# Altium schematic sheet STM32F103C8T6_Subentry.SchDoc
size 558 x 520 mm
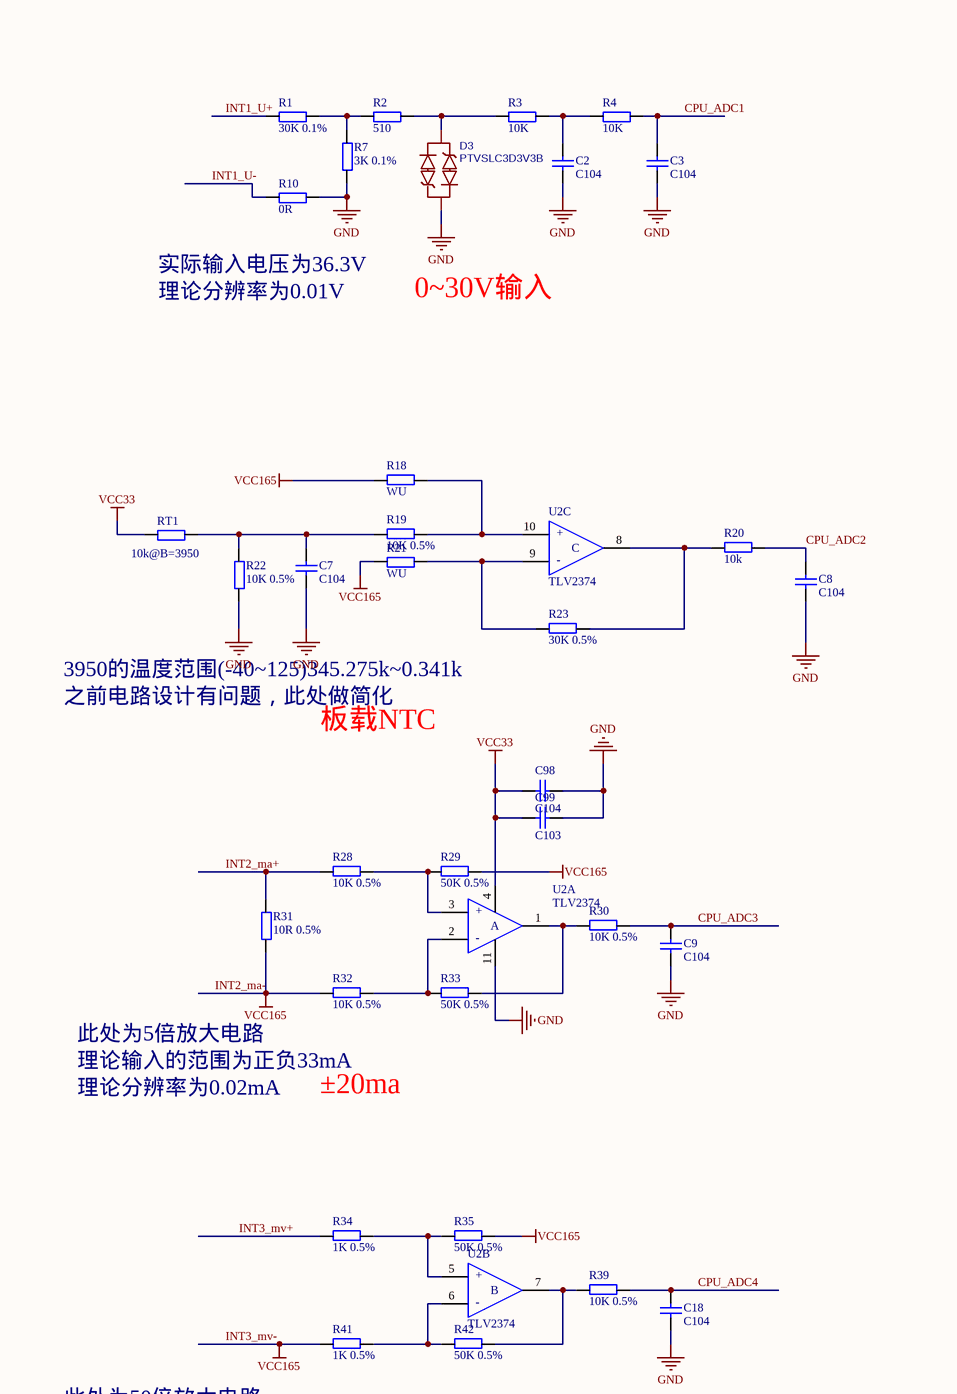
[diagram p0: STM32F103C8T6_Subentry.SchDoc, top left]
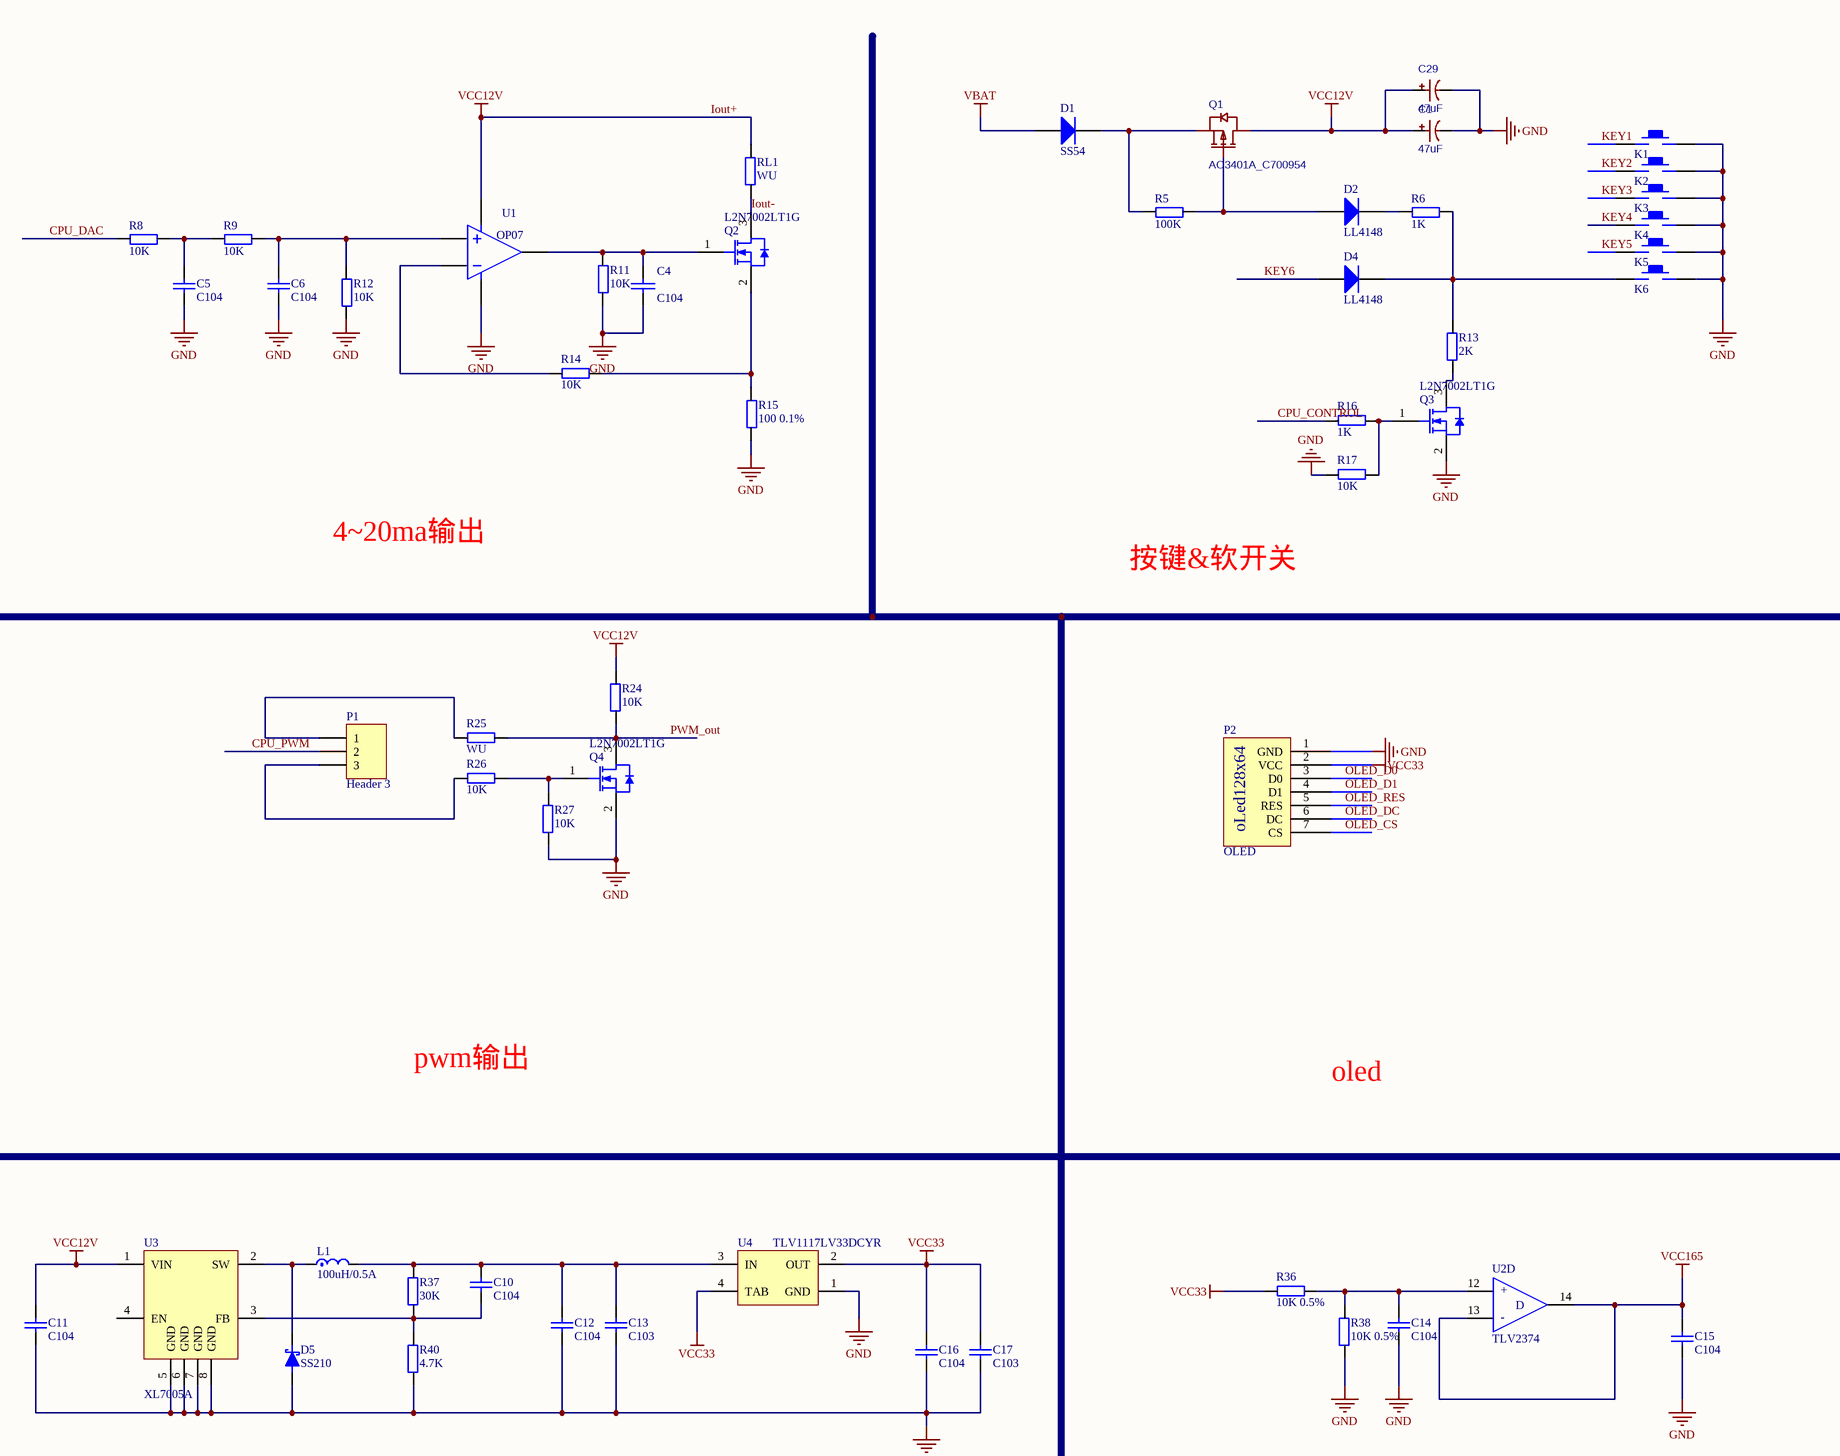
[diagram p1: STM32F103C8T6_Subentry.SchDoc, top right]
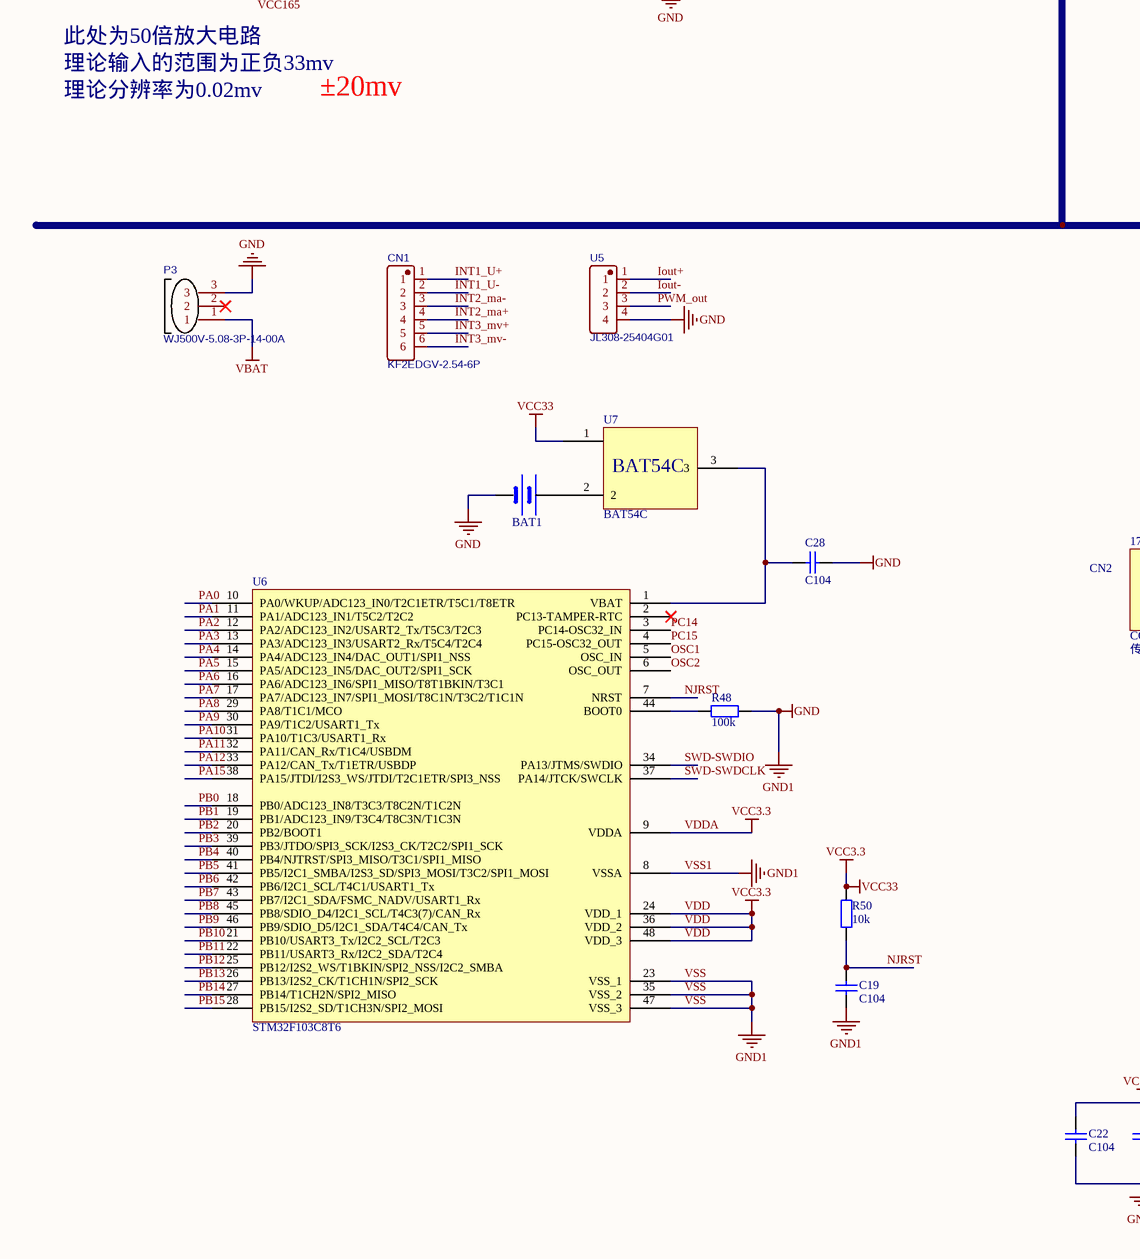
[diagram p2: STM32F103C8T6_Subentry.SchDoc, bottom left]
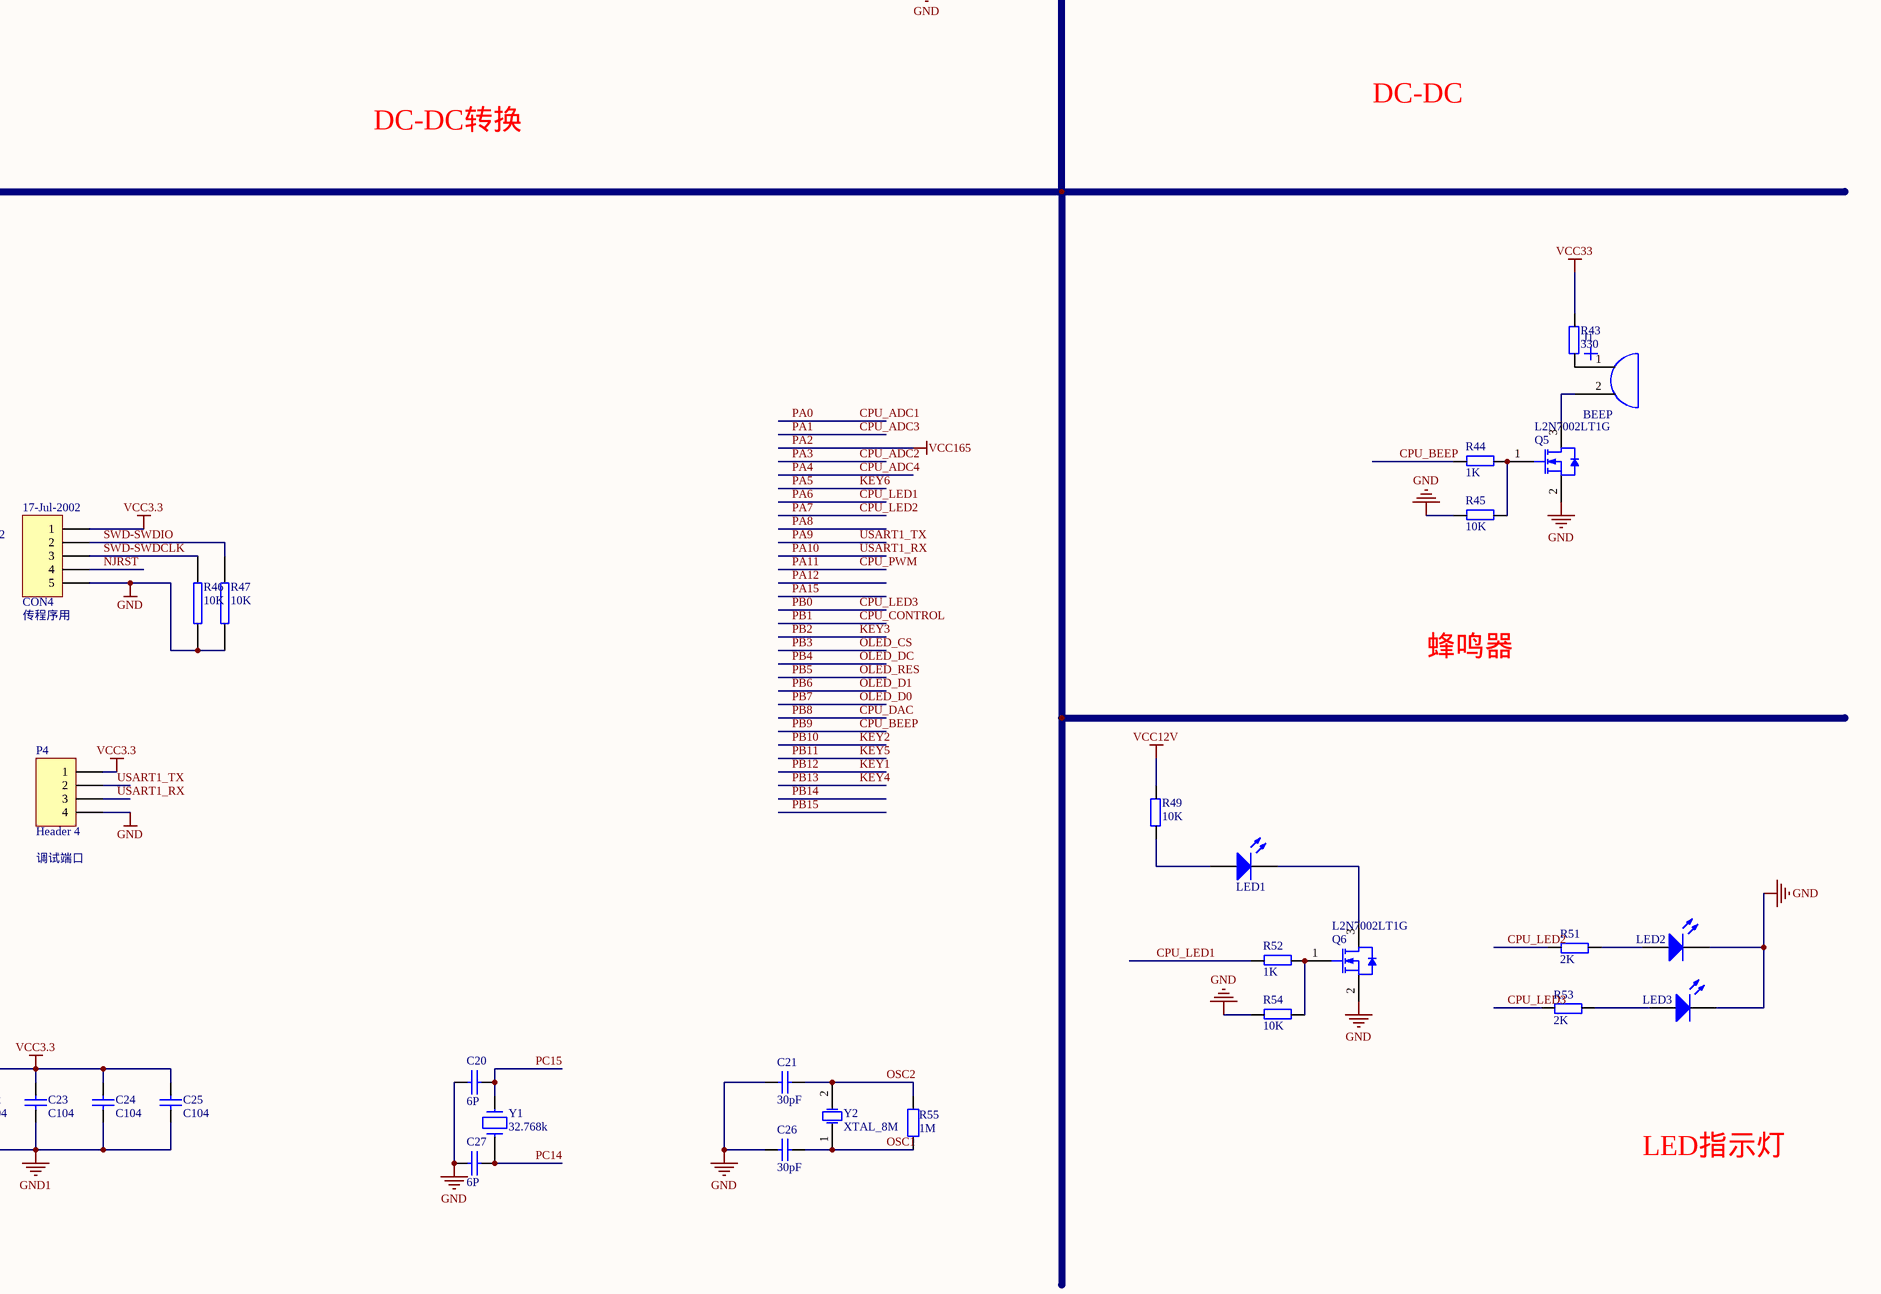
[diagram p3: STM32F103C8T6_Subentry.SchDoc, bottom right]

## Parts
BAT1  BATT  [CR1220]  (value not drawn)
C1  47uF  [CAP-TH_BD5.0-P2.00-D0.8-FD]
C2  C104  [C0805]
C3  C104  [C0805]
C4  C104  [C0805]
C5  C104  [C0805]
C6  C104  [C0805]
C7  C104  [C0805]
C8  C104  [C0805]
C9  C104  [C0805]
C10  C104  [C0805]
C11  C104  [C0805]
C12  C104  [C0805]
C13  C103  [C0805]
C14  C104  [C0805]
C15  C104  [C0805]
C16  C104  [C0805]
C17  C103  [C0805]
C18  C104  [C0805]
C19  C104  [C0805]
C20  6P  [C0805]
C21  30pF  [C0805]
C22  C104  [C0805]
C23  C104  [C0805]
C24  C104  [C0805]
C25  C104  [C0805]
C26  30pF  [C0805]
C27  6P  [C0805]
C28  C104  [C0805]
C29  47uF  [CAP-TH_BD5.0-P2.00-D0.8-FD]
C98  C104  [C0805]
C99  C103  [C0805]
CN1  KF2EDGV-2.54-6P  [CONN-TH_6P-P2.54_KF2EDGV-2.54-6P]
CN2  CON4  LatestRevisionDate: 17-Jul-2002  [HDR1X5]
D1  SS54  [DIODE-SMB]
D2  LL4148  [LL-34_L3.5-W1.5-RD]
D3  PTVSLC3D3V3B  [SOD-323_L1.8-W1.3-LS2.5-BI]
D4  LL4148  [LL-34_L3.5-W1.5-RD]
D5  SS210  [SMA]
J1  BEEP  [Beep]
K1  KEY_M  [K0.25]  (value not drawn)
K2  KEY_M  [K0.25]  (value not drawn)
K3  KEY_M  [K0.25]  (value not drawn)
K4  KEY_M  [K0.25]  (value not drawn)
K5  KEY_M  [K0.25]  (value not drawn)
K6  KEY_M  [K0.25]  (value not drawn)
L1  100uH/0.5A  [L0630]
LED1  LED  [LED-0603 - duplicate]  (value not drawn)
LED2  LED  [LED-0603 - duplicate]  (value not drawn)
LED3  LED  [LED-0603 - duplicate]  (value not drawn)
P1  Header 3  [HDR1X3]
P2  OLED  [OLED]
P3  WJ500V-5.08-3P-14-00A  [CONN-TH_3P-P5.00_WJ500V-5.08-3P]
P4  Header 4  [HDR1X4]
Q1  AO3401A_C700954  [SOT-23]
Q2  L2N7002LT1G  [SOT-23]
Q3  L2N7002LT1G  [SOT-23]
Q4  L2N7002LT1G  [SOT-23]
Q5  L2N7002LT1G  [SOT-23]
Q6  L2N7002LT1G  [SOT-23]
R1  30K 0.1%  [R1206]
R2  510  [R0805]
R3  10K  [R0805]
R4  10K  [R0805]
R5  100K  [R0805]
R6  1K  [R0805]
R7  3K 0.1%  [R1206]
R8  10K  [R0805]
R9  10K  [R0805]
R10  0R  [R1206]
R11  10K  [R0805]
R12  10K  [R0805]
R13  2K  [R0805]
R14  10K  [R0805]
R15  100 0.1%  [R0805]
R16  1K  [R0805]
R17  10K  [R0805]
R18  WU  [R0805]
R19  10K 0.5%  [R0805]
R20  10k  [R0805]
R21  WU  [R0805]
R22  10K 0.5%  [R0805]
R23  30K 0.5%  [R0805]
R24  10K  [R0805]
R25  WU  [R0805]
R26  10K  [R0805]
R27  10K  [R0805]
R28  10K 0.5%  [R0805]
R29  50K 0.5%  [R0805]
R30  10K 0.5%  [R0805]
R31  10R 0.5%  [R0805]
R32  10K 0.5%  [R0805]
R33  50K 0.5%  [R0805]
R34  1K 0.5%  [R0805]
R35  50K 0.5%  [R0805]
R36  10K 0.5%  [R0805]
R37  30K  [R0805]
R38  10K 0.5%  [R0805]
R39  10K 0.5%  [R0805]
R40  4.7K  [R0805]
R41  1K 0.5%  [R0805]
R42  50K 0.5%  [R0805]
R43  330  [R0805]
R44  1K  [R0805]
R45  10K  [R0805]
R46  10K  [R0805]
R47  10K  [R0805]
R48  100k  [R0805]
R49  10K  [R0805]
R50  10k  [R0805]
R51  2K  [R0805]
R52  1K  [R0805]
R53  2K  [R0805]
R54  10K  [R0805]
R55  1M  [R0805]
RL1  WU  [R1206]
RT1  10k@B=3950  [R0603]
U1  OP07  [SOP8]
U2  TLV2374  [SOP14]  (parts A,B,C,D of 4)
U3  XL7005A  [SOP8]
U4  TLV1117LV33DCYR  [SOT-223]
U5  JL308-25404G01  [CONN-TH_4P-P2.54_JILN_JL308-25404G01]
U6  STM32F103C8T6  [LQFP48_L]
U7  BAT54C  [SOT-23]
Y1  32.768k  [XTAL32]
Y2  XTAL_8M  [XTAL_US]

## Nets
INT2_ma-: C15.2 CN1.3 CN1.6 R18.2 R21.1 R29.1 R31.1 R32.2 R35.1 R41.2 U2.13(4IN-) U2.14(4OUT) U6.12(PA2/ADC123_IN2/USART2_Tx/T5C3/T2C3)  [also labelled INT3_mv-, PA2, VCC165]
Iout+: C1.1 C11.2 C29.1 Q1.3(D) R24.1 R49.1 RL1.1 U1.7 U3.1(VIN) U5.1  [also labelled VCC12V]
VBAT: D1.1(A) P3.1
VDD: C16.2 C17.2 C22.2 C23.2 C24.2 C25.2 C98.2 C99.2 CN2.1 P2.2(VCC) P4.1 R36.2 R43.1 R50.2 RT1.1 U2.4(VCC) U4.2(OUT) U4.4(TAB) U6.9(VDDA) U6.24(VDD_1) U6.36(VDD_2) U6.48(VDD_3) U7.1  [also labelled VCC3.3, VCC33, VDDA]
VSS: BAT1.2(GND) C1.2 C2.1 C3.1 C4.2 C5.1 C6.1 C7.1 C8.1 C9.1 C11.1 C12.1 C13.1 C14.1 C15.1 C16.1 C17.1 C18.1 C19.1 C20.2 C21.2 C22.1 C23.1 C24.1 C25.1 C26.2 C27.2 C28.1 C29.2 C98.1 C99.1 CN2.5 D3.1 D5.1(A) K1.1 K2.1 K3.1 K4.1 K5.1 K6.2 LED2.2(K) LED3.2(K) P2.1(GND) P3.3 P4.4 Q3.2(S) Q4.2(S) Q5.2(S) Q6.2(S) R7.1 R10.2 R11.1 R12.1 R15.1 R17.2 R22.1 R27.2 R38.2 R40.2 R45.2 R46.1 R47.1 R48.2 R54.2 U1.4 U2.11(GND) U3.5(GND) U3.6(GND) U3.7(GND) U3.8(GND) U4.1(GND) U5.4 U6.8(VSSA) U6.23(VSS_1) U6.35(VSS_2) U6.47(VSS_3)  [also labelled GND, GND1, VSS1]
CPU_ADC1: C3.2 R4.2 U6.10(PA0/WKUP/ADC123_IN0/T2C1ETR/T5C1/T8ETR)  [also labelled PA0]
CPU_ADC2: C8.2 R20.1 U6.13(PA3/ADC123_IN3/USART2_Rx/T5C4/T2C4)  [also labelled PA3]
CPU_ADC3: C9.2 R30.1 U6.11(PA1/ADC123_IN1/T5C2/T2C2)  [also labelled PA1]
CPU_ADC4: C18.2 R39.1 U6.14(PA4/ADC123_IN4/DAC_OUT1/SPI1_NSS)  [also labelled PA4]
CPU_BEEP: R44.2 U6.46(PB9/SDIO_D5/I2C1_SDA/T4C4/CAN_Tx)  [also labelled PB9]
CPU_CONTROL: R16.2 U6.19(PB1/ADC123_IN9/T3C4/T8C3N/T1C3N)  [also labelled PB1]
CPU_DAC: R8.1 U6.45(PB8/SDIO_D4/I2C1_SCL/T4C3(7)/CAN_Rx)  [also labelled PB8]
CPU_LED1: R52.2 U6.16(PA6/ADC123_IN6/SPI1_MISO/T8T1BKIN/T3C1)  [also labelled PA6]
CPU_LED2: R51.1 U6.17(PA7/ADC123_IN7/SPI1_MOSI/T8C1N/T3C2/T1C1N)  [also labelled PA7]
CPU_LED3: R53.1 U6.18(PB0/ADC123_IN8/T3C3/T8C2N/T1C2N)  [also labelled PB0]
CPU_PWM: P1.2 U6.32(PA11/CAN_Rx/T1C4/USBDM)  [also labelled PA11]
INT1_U+: CN1.1 R1.1
INT1_U-: CN1.2 R10.1
INT2_ma+: CN1.4 R28.2 R31.2
INT3_mv+: CN1.5 R34.2
Iout-: Q2.3(D) RL1.2 U5.2
KEY1: K1.2 U6.25(PB12/I2S2_WS/T1BKIN/SPI2_NSS/I2C2_SMBA)  [also labelled PB12]
KEY2: K2.2 U6.21(PB10/USART3_Tx/I2C2_SCL/T2C3)  [also labelled PB10]
KEY3: K3.2 U6.20(PB2/BOOT1)  [also labelled PB2]
KEY4: K4.2 U6.26(PB13/I2S2_CK/T1CH1N/SPI2_SCK)  [also labelled PB13]
KEY5: K5.2 U6.22(PB11/USART3_Rx/I2C2_SDA/T2C4)  [also labelled PB11]
KEY6: D4.1(A) U6.15(PA5/ADC123_IN5/DAC_OUT2/SPI1_SCK)  [also labelled PA5]
NJRST: C19.2 CN2.4 R50.1 U6.7(NRST)
OLED_CS: P2.7(CS) U6.39(PB3/JTDO/SPI3_SCK/I2S3_CK/T2C2/SPI1_SCK)  [also labelled PB3]
OLED_D0: P2.3(D0) U6.43(PB7/I2C1_SDA/FSMC_NADV/USART1_Rx)  [also labelled PB7]
OLED_D1: P2.4(D1) U6.42(PB6/I2C1_SCL/T4C1/USART1_Tx)  [also labelled PB6]
OLED_DC: P2.6(DC) U6.40(PB4/NJTRST/SPI3_MISO/T3C1/SPI1_MISO)  [also labelled PB4]
OLED_RES: P2.5(RES) U6.41(PB5/I2C1_SMBA/I2S3_SD/SPI3_MOSI/T3C2/SPI1_MOSI)  [also labelled PB5]
OSC1: C26.1 R55.1 U6.5(OSC_IN) Y2.1(OSC1)
OSC2: C21.1 R55.2 U6.6(OSC_OUT) Y2.2(OSC2)
PA8: U6.29(PA8/T1C1/MCO)
PA9: P4.2 U6.30(PA9/T1C2/USART1_Tx)  [also labelled USART1_TX]
PA10: P4.3 U6.31(PA10/T1C3/USART1_Rx)  [also labelled USART1_RX]
PA12: U6.33(PA12/CAN_Tx/T1ETR/USBDP)
PA15: U6.38(PA15/JTDI/I2S3_WS/JTDI/T2C1ETR/SPI3_NSS)
PB14: U6.27(PB14/T1CH2N/SPI2_MISO)
PB15: U6.28(PB15/I2S2_SD/T1CH3N/SPI2_MOSI)
PC14: C27.1 U6.3(PC14-OSC32_IN) Y1.1
PC15: C20.1 U6.4(PC15-OSC32_OUT) Y1.2
PWM_out: Q4.3(D) R24.2 R25.1 U5.3
SWD-SWDCLK: CN2.3 R46.2 U6.37(PA14/JTCK/SWCLK)
SWD-SWDIO: CN2.2 R47.2 U6.34(PA13/JTMS/SWDIO)
NetBAT1_1: BAT1.1(VCC) U7.2
NetC2_2: C2.2 R3.2 R4.1
NetC4_1: C4.1 Q2.1(G) R11.2 U1.6
NetC5_2: C5.2 R8.2 R9.1
NetC6_2: C6.2 R9.2 R12.2 U1.3
NetC7_2: C7.2 R19.2 R22.2 RT1.2
NetC10_1: C10.1 R37.2 R40.1 U3.3(FB)
NetC10_2: C10.2 C12.2 C13.2 L1.2 R37.1 U4.3(IN)
NetC14_2: C14.2 R36.1 R38.1 U2.12(4IN+)
NetC28_2: C28.2 U6.1(VBAT) U7.3
NetD1_2: D1.2(K) Q1.2(S) R5.1
NetD2_1: D2.1(A) Q1.1(G) R5.2
NetD2_2: D2.2(K) R6.1
NetD3_2: D3.2 R2.2 R3.1
NetD4_2: D4.2(K) K6.1 R6.2 R13.1
NetD5_2: D5.2(K) L1.1 U3.2(SW)
NetJ1_1: J1.1 R43.2
NetJ1_2: J1.2 Q5.3(D)
NetLED1_1: LED1.1(A) R49.2
NetLED1_2: LED1.2(K) Q6.3(D)
NetLED2_1: LED2.1(A) R51.2
NetLED3_1: LED3.1(A) R53.2
NetP1_1: P1.1 R25.2
NetP1_3: P1.3 R26.2
NetQ2_2: Q2.2(S) R14.1 R15.2
NetQ3_1: Q3.1(G) R16.1 R17.1
NetQ3_3: Q3.3(D) R13.2
NetQ4_1: Q4.1(G) R26.1 R27.1
NetQ5_1: Q5.1(G) R44.1 R45.1
NetQ6_1: Q6.1(G) R52.1 R54.1
NetR1_2: R1.2 R2.1 R7.2
NetR14_2: R14.2 U1.2
NetR18_1: R18.1 R19.1 U2.10(3IN+)
NetR20_2: R20.2 R23.1 U2.8(3OUT)
NetR21_2: R21.2 R23.2 U2.9(3IN-)
NetR28_1: R28.1 R29.2 U2.3(1IN+)
NetR30_2: R30.2 R33.1 U2.1(1OUT)
NetR32_1: R32.1 R33.2 U2.2(1IN-)
NetR34_1: R34.1 R35.2 U2.5(2IN+)
NetR39_2: R39.2 R42.1 U2.7(2OUT)
NetR41_1: R41.1 R42.2 U2.6(2IN-)
NetR48_1: R48.1 U6.44(BOOT0)

Not connected (* = marked no-connect by the designer): P3 2*; U3 4(EN); U6 2(PC13-TAMPER-RTC)*

## Notes on the sheet
- 实际输入电压为36.3V
- 理论分辨率为0.01V
- 0~30V输入
- 4~20ma输出
- 按键&软开关
- 3950的温度范围(-40~125)345.275k~0.341k
- 之前电路设计有问题，此处做简化
- 板载NTC
- 此处为5倍放大电路
- pwm输出
- oled
- 理论输入的范围为正负33mA
- 理论分辨率为0.02mA
- ±20ma
- 此处为50倍放大电路
- 理论输入的范围为正负33mv
- 理论分辨率为0.02mv
- ±20mv
- DC-DC转换
- DC-DC
- (near CN2) 传程序用
- 蜂鸣器
- (near P4) 调试端口
- LED指示灯
- (in symbol OLED) oLed128x64
- (in symbol TLV2374, part A) +; A; -
- (in symbol TLV2374, part B) +; B; -
- (in symbol TLV2374, part C) +; C; -
- (in symbol TLV2374, part D) +; D; -

## Library data of the parts
BAT1 = BAT
C1 C29 = 47uF: BOM_Manufacturer: Rubycon; BOM_Manufacturer Part: 35YXJ47M5X11; nameAlias: Capacitance; BOM_Supplier: LCSC; BOM_Supplier Part: C88761; BOM_JLCPCB Part Class: Extended Part; spicePre: C; spiceSymbolName: 35YXJ47M5X11
C2 C3 C5-C19 C22-C25 C28 C98 C99 = Cap: Capacitor; Value: 0.1uF; Published: 8-Jun-2000; LatestRevisionDate: 17-Jul-2002; LatestRevisionNote: Re-released for DXP Platform.; PackageReference: RAD-0.3; Publisher: Altium Limited; PackageDescription: Radial Cap, Thru-Hole; 2 Leads; 0.3 in Pin Spacing
C4 C20 C27 = CAP: Capacitor
C21 C26 = Cap: Capacitor; Published: 8-Jun-2000; LatestRevisionDate: 17-Jul-2002; LatestRevisionNote: Re-released for DXP Platform.; PackageReference: RAD-0.3; Publisher: Altium Limited; PackageDescription: Radial Cap, Thru-Hole; 2 Leads; 0.3 in Pin Spacing; Value: 30pF
CN1 = KF2EDGV-2.54-6P: BOM_Manufacturer: Cixi Kefa Elec; Contributor: LCSC; BOM_Supplier: LCSC; BOM_Supplier Part: C577589; BOM_Manufacturer Part: KF2EDGV-2.54-6P; BOM_JLCPCB Part Class: Extended Part; spicePre: C; spiceSymbolName: KF2EDGV-2.54-6P
CN2 = Header 5: Header, 5-Pin; LatestRevisionNote: Re-released for DXP Platform.; Publisher: Altium Limited
D1 = Diode 1N5404: 3 Amp General Purpose Rectifier; Published: 8-Jun-2000; LatestRevisionDate: 17-Jul-2002; LatestRevisionNote: Re-released for DXP Platform.; DatasheetVersion: 1998; PackageVersion: Aug-1999; PackageReference: DO-201AD; Publisher: Altium Limited; PackageDescription: Diode, Axial; Body 9.5 x 5.6 mm (LxDia. max), Lead Dia. 1.32 mm (max); ComponentLink1Description: Manufacturer Link; ComponentLink1URL: http://www.fairchildsemi.com/; ComponentLink2Description: Datasheet; ComponentLink2URL: http://www.fairchildsemi.com/ds/1N%2F1N5400.pdf
D2 D4 = Diode: Default Diode; Published: 8-Jun-2000; LatestRevisionDate: 17-Jul-2002; LatestRevisionNote: Re-released for DXP Platform.; PackageVersion: Sep-1996; PackageReference: SMC; Publisher: Altium Limited; PackageDescription: DO-214-AB/SMC; 2 C-Bend Leads; Body 7.9 x 5.9 mm, inc. leads (LxW); Code_JEDEC: DO-214-AB
D3 = PTVSLC3D3V3B: BOM_Manufacturer: Shanghai Prisemi Elec; Contributor: LCSC; BOM_Supplier: LCSC; BOM_Supplier Part: C246774; BOM_Manufacturer Part: PTVSLC3D3V3B; BOM_JLCPCB Part Class: Extended Part; spicePre: D; spiceSymbolName: PTVSLC3D3V3B
D5 = DIODE SCHOTTKY
J1 = BEEP: 蜂鸣器
L1 = INDUTOR
LED1-LED3 = LED: 白色贴片指示灯; Published: 8-Jun-2000; LatestRevisionDate: 17-Jul-2002; LatestRevisionNote: Re-released for DXP Platform.; PackageDocument: Feb-2002; PackageReference: 3.2X1.6X1.1; Publisher: Altium Limited
P1 = Header 3: Header, 3-Pin; LatestRevisionDate: 17-Jul-2002; LatestRevisionNote: Re-released for DXP Platform.; Publisher: Altium Limited
P3 = WJ500V-5.08-3P-14-00A: BOM_Manufacturer: ReliaPro; BOM_Supplier: LCSC; BOM_Manufacturer Part: WJ500V-5.08-3P-14-00A; BOM_Supplier Part: C72334; BOM_JLCPCB Part Class: Extended Part; spicePre: P; spiceSymbolName: WJ500V-5.08-3P-14-00A
P4 = Header 4: Header, 4-Pin; LatestRevisionDate: 17-Jul-2002; LatestRevisionNote: Re-released for DXP Platform.; Publisher: Altium Limited
Q1 = AO3401A_C700954: BOM_Manufacturer: HUASHUO(华朔); Contributor: LCSC; BOM_Supplier: LCSC; BOM_Supplier Part: C700954; BOM_Manufacturer Part: AO3401A; BOM_JLCPCB Part Class: Extended Part; spicePre: Q; spiceSymbolName: AO3401A_C700954
Q2-Q6 = 2N7002: N-channel Enhancement Mode Field-effect Transistor; Published: 17-Sep-2003; LatestRevisionDate: 12-Dec-2006; LatestRevisionNote: IPC-7351 Footprint Added.; DatasheetVersion: 27-Jul-2000; PackageVersion: May-1999; PackageReference: SOT23; Publisher: Altium Limited; PackageDescription: 3-Pin SOT-23 Package 0.95 mm Pitch, 2.3 mm Lead Span; ComponentLink1Description: Manufacturer Link; ComponentLink1URL: http://www.semiconductors.philips.com/; ComponentLink2Description: Datasheet; ComponentLink2URL: http://www.semiconductors.philips.com/acrobat/datasheets/2N7002_4.pdf
R1-R4 R6-R45 R49 R51-R54 RL1 RT1 = R: R202-0603
R5 = RES: 电阻
R46 R47 = RES2
R48 R50 R55 = Res2: Resistor; Published: 8-Jun-2000; LatestRevisionDate: 17-Jul-2002; LatestRevisionNote: Re-released for DXP Platform.; PackageReference: AXIAL-0.4; Publisher: Altium Limited; PackageDescription: Axial Device, Thru-Hole; 2 Leads; 0.4 in Pin Spacing
  R48: Value: 100K
  R50: Value: 10K
  R55: Value: 1M
U1 = OP07C
U3 = XL7005A: step dowm DC/DC
U4 = LM1117IMPX-3.3/NOPB: 800mA Low-Dropout Linear Regulator, 4-pin SOT-223, Pb-Free; Manufacturer: National Semiconductor; PackageTopMarking: XYTT*N05B; PowerWise: N; CompType: LDO IC; Published: 1-Mar-2010; DatasheetVersion: Apr-2006; PackageVersion: revB, Apr-2003; PackageReference: MP04A; Publisher: Altium Limited; PackageDescription: Molded SOT-223, 6.50 x 3.56 x 1.6mm Body, 4 Lead, 2.3mm Pitch; Supplier 1: Digi-Key; Supplier Part Number 1: LM1117IMPX-3.3-ND; PartNumber: LM1117IMPX-3.3/NOPB; RoHS: Y; PinCount: 4; Code_JEDEC: TO-261-AA; Code_IPC: SOT223-4; ComponentLink1Description: LM1117 Datasheet; ComponentLink1URL: http://www.national.com/ds/LM/LM1117.pdf; ComponentLink2Description: LM1117 Web Page; ComponentLink2URL: http://www.national.com/pf/LM/LM1117.html; ComponentLink3Description: MP04A Package Page; ComponentLink3URL: http://www.national.com/packaging/folders/mp04a.html
U5 = JL308-25404G01: BOM_Manufacturer: JILN(锦凌); Contributor: LCSC; BOM_Supplier: LCSC; BOM_Supplier Part: C2922599; BOM_Manufacturer Part: JL308-25404G01; spicePre: U; spiceSymbolName: JL308-25404G01
U6 = STM32F103C: STM32单片机48引脚
Y1 = CRYSTAL
Y2 = XTAL: Crystal Oscillator; Published: 8-Jun-2000; LatestRevisionDate: 17-Jul-2002; LatestRevisionNote: Re-released for DXP Platform.; PackageReference: R38; Publisher: Altium Limited; PackageDescription: Crystal, Thru-Hole; 2 Leads; Body 3.1 x 8.2 mm (Dia.xH)